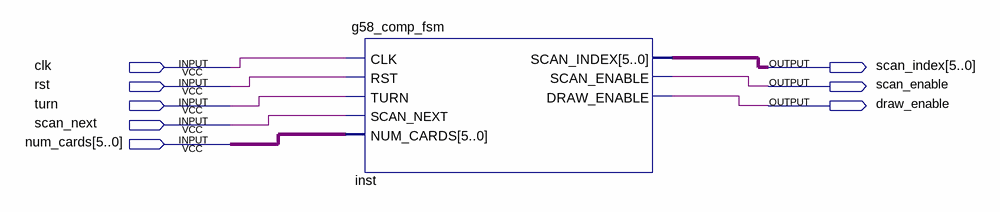
[diagram p0: schematic sheet]
// Quartus schematic g58_comp_fsm_test.bdf as structural Verilog: 1 symbols, 8 pins
module g58_comp_fsm_test (
  input  clk,
  input  rst,
  input  turn,
  input  scan_next,
  input  [5:0] num_cards,
  output [5:0] scan_index,
  output scan_enable,
  output draw_enable
);

  g58_comp_fsm inst (
    .CLK(clk), .RST(rst), .TURN(turn), .SCAN_NEXT(scan_next), .NUM_CARDS(num_cards), .SCAN_INDEX(scan_index),
    .SCAN_ENABLE(scan_enable), .DRAW_ENABLE(draw_enable));
endmodule
